# Altium schematic sheet ARM7_Sharp_LH79520_LCD.SchDoc
size B; DocumentNumber: 1; SheetNumber: 1; SheetTotal: 1
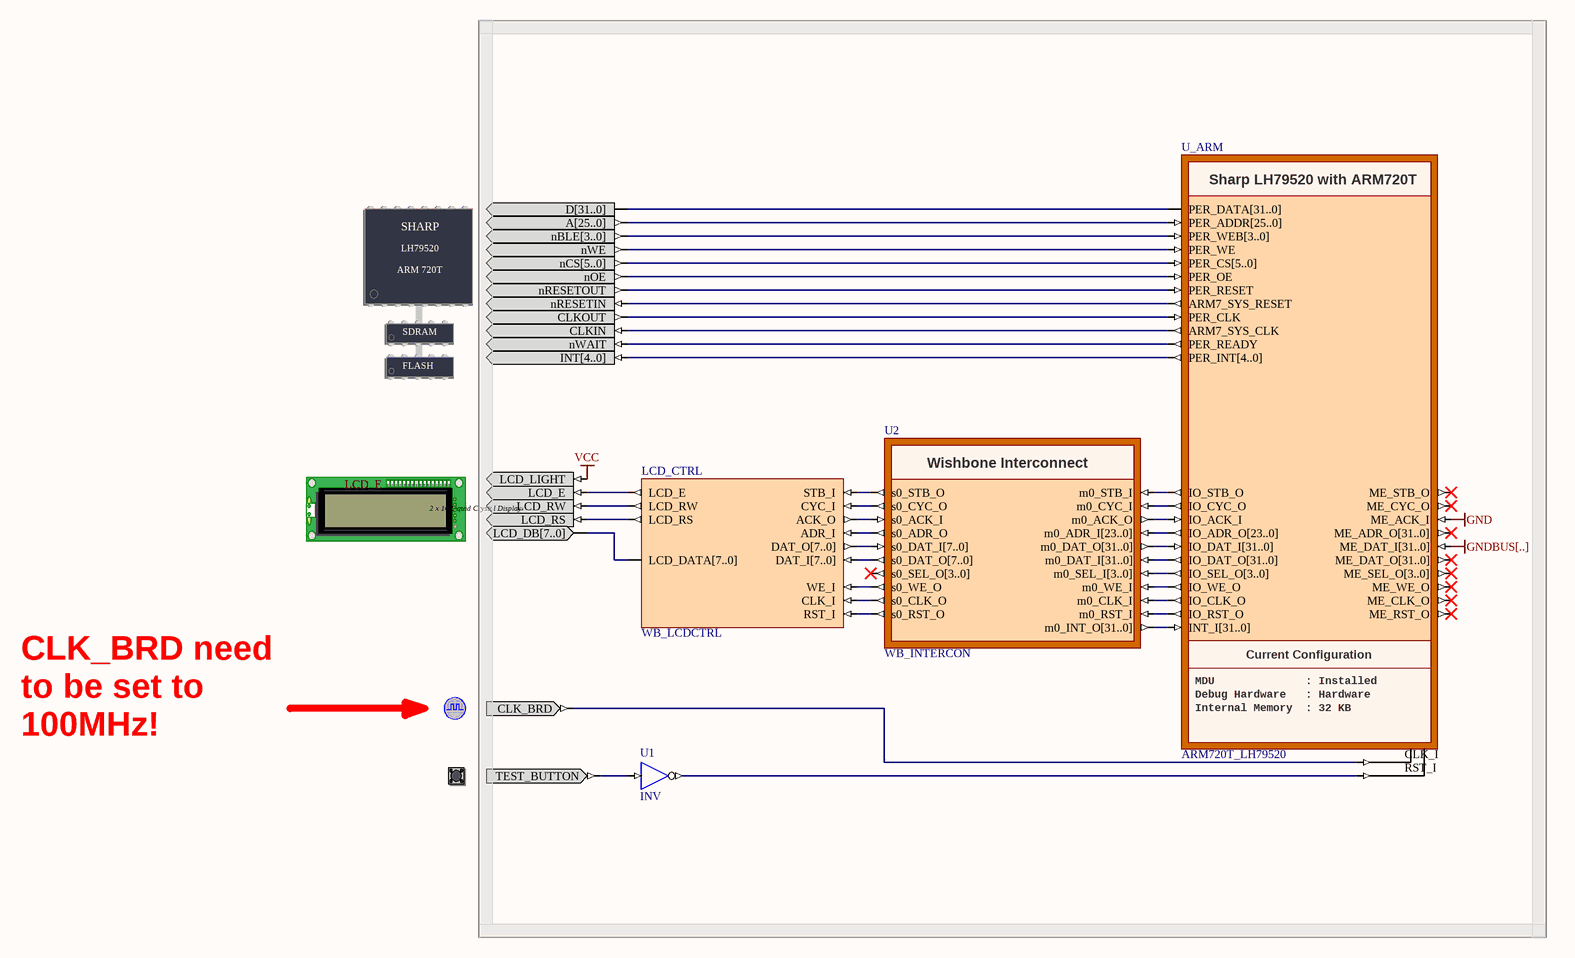
[diagram p0: ARM7_Sharp_LH79520_LCD.SchDoc]

## Parts
(Parts that share a designator on the sheet are numbered #1, #2 ... from top to bottom, then left to right.)
?#1  PROCESSOR_ARM7_LH79520  (value not drawn)
?#2  LCD  (value not drawn)
?#3  CLOCK_BOARD  (value not drawn)
?#4  TEST_BUTTON  (value not drawn)
LCD_CTRL  WB_LCDCTRL
U1  INV
U2  WB_INTERCON
U_ARM  ARM720T_LH79520

## Nets
GND: U_ARM.ME_ACK_I
GNDBUS[..]: U_ARM.ME_DAT_I[31..0]
VCC: ?#2.LCD_LIGHT
Net?#1_A[25..0]: ?#1.A[25..0] U_ARM.PER_ADDR[25..0]
Net?#1_CLKIN: ?#1.CLKIN U_ARM.ARM7_SYS_CLK
Net?#1_CLKOUT: ?#1.CLKOUT U_ARM.PER_CLK
Net?#1_D[31..0]: ?#1.D[31..0] U_ARM.PER_DATA[31..0]
Net?#1_INT[4..0]: ?#1.INT[4..0] U_ARM.PER_INT[4..0]
Net?#1_nBLE[3..0]: ?#1.nBLE[3..0] U_ARM.PER_WEB[3..0]
Net?#1_nCS[5..0]: ?#1.nCS[5..0] U_ARM.PER_CS[5..0]
Net?#1_nOE: ?#1.nOE U_ARM.PER_OE
Net?#1_nRESETIN: ?#1.nRESETIN U_ARM.ARM7_SYS_RESET
Net?#1_nRESETOUT: ?#1.nRESETOUT U_ARM.PER_RESET
Net?#1_nWAIT: ?#1.nWAIT U_ARM.PER_READY
Net?#1_nWE: ?#1.nWE U_ARM.PER_WE
Net?#2_LCD_DB[7..0]: ?#2.LCD_DB[7..0] LCD_CTRL.LCD_DATA[7..0]
Net?#2_LCD_E: ?#2.LCD_E LCD_CTRL.LCD_E
Net?#2_LCD_RS: ?#2.LCD_RS LCD_CTRL.LCD_RS
Net?#2_LCD_RW: ?#2.LCD_RW LCD_CTRL.LCD_RW
Net?#3_CLK_BRD: ?#3.CLK_BRD U_ARM.CLK_I
Net?#4_TEST_BUTTON: ?#4.TEST_BUTTON U1.I
NetLCD_CTRL_ACK_O: LCD_CTRL.ACK_O U2.s0_ACK_I
NetLCD_CTRL_ADR_I: LCD_CTRL.ADR_I U2.s0_ADR_O
NetLCD_CTRL_CLK_I: LCD_CTRL.CLK_I U2.s0_CLK_O
NetLCD_CTRL_CYC_I: LCD_CTRL.CYC_I U2.s0_CYC_O
NetLCD_CTRL_DAT_I[7..0]: LCD_CTRL.DAT_I[7..0] U2.s0_DAT_O[7..0]
NetLCD_CTRL_DAT_O[7..0]: LCD_CTRL.DAT_O[7..0] U2.s0_DAT_I[7..0]
NetLCD_CTRL_RST_I: LCD_CTRL.RST_I U2.s0_RST_O
NetLCD_CTRL_STB_I: LCD_CTRL.STB_I U2.s0_STB_O
NetLCD_CTRL_WE_I: LCD_CTRL.WE_I U2.s0_WE_O
NetU1_O: U1.O U_ARM.RST_I
NetU2_m0_ACK_O: U2.m0_ACK_O U_ARM.IO_ACK_I
NetU2_m0_ADR_I[23..0]: U2.m0_ADR_I[23..0] U_ARM.IO_ADR_O[23..0]
NetU2_m0_CLK_I: U2.m0_CLK_I U_ARM.IO_CLK_O
NetU2_m0_CYC_I: U2.m0_CYC_I U_ARM.IO_CYC_O
NetU2_m0_DAT_I[31..0]: U2.m0_DAT_I[31..0] U_ARM.IO_DAT_O[31..0]
NetU2_m0_DAT_O[31..0]: U2.m0_DAT_O[31..0] U_ARM.IO_DAT_I[31..0]
NetU2_m0_INT_O[31..0]: U2.m0_INT_O[31..0] U_ARM.INT_I[31..0]
NetU2_m0_RST_I: U2.m0_RST_I U_ARM.IO_RST_O
NetU2_m0_SEL_I[3..0]: U2.m0_SEL_I[3..0] U_ARM.IO_SEL_O[3..0]
NetU2_m0_STB_I: U2.m0_STB_I U_ARM.IO_STB_O
NetU2_m0_WE_I: U2.m0_WE_I U_ARM.IO_WE_O

Not connected (* = marked no-connect by the designer): U2 s0_SEL_O[3..0]*; U_ARM ME_ADR_O[31..0]* ME_CLK_O* ME_CYC_O* ME_DAT_O[31..0]* ME_RST_O* ME_SEL_O[3..0]* ME_STB_O* ME_WE_O*

## Notes on the sheet
- CLK_BRD need to be set to 100MHz!
- Labels drawn without touching a wire or pin: LCD_E
- Title
- Size:
- Date:
- B
- Number:
- Time:
- Revision:
- Sheet
- of
- File:
- (in symbol ARM720T_LH79520) Sharp LH79520 with ARM720T; Current Configuration; MDU              : Installed; Debug Hardware   : Hardware; Internal Memory  : 32 KB
- (in symbol LCD) 2 x 16 Liquid Crystal Display
- (in symbol PROCESSOR_ARM7_LH79520) SHARP; LH79520; ARM 720T; SDRAM; FLASH
- (in symbol WB_INTERCON) Wishbone Interconnect

## Library data of the parts
?#1 = PROCESSOR_ARM7_LH79520: Sharp LH79520 with ARM 720T; PortComponent: True; Published: 06-Oct-2005; Publisher: Altium Limited; HelpURL: http://document.sharpsma.com/Handler/getfile_handler2.asp?nodeid=Documents&fileid=F91E6650EC6141068DF7F13902FCDBE4
?#2 = LCD: Liquid Crystal Display; PortComponent: True; Published: 19-Nov-2003; Publisher: Altium Limited; HelpURL: TR0102 NanoBoard Technical Reference Manual - NB1.pdf#page=39
?#3 = CLOCK_BOARD: Global System Clock Supply; PortComponent: True; Published: 19-Nov-2003; Publisher: Altium Limited; HelpURL: TR0102 NanoBoard Technical Reference Manual - NB1.pdf#page=29
?#4 = TEST_BUTTON: Test Button; PortComponent: True; Published: 19-Nov-2003; Publisher: Altium Limited; HelpURL: TR0102 NanoBoard Technical Reference Manual - NB1.pdf#page=41
LCD_CTRL = WB_LCDCTRL: LCD Controller Wishbone; ArchiveName: GENERIC; Published: 9-Dec-2004; Publisher: Altium Limited; ComponentLink1Description: Core &Resource Usage; ComponentLink1URL: CR0139 FPGA Peripheral Resource Usage.pdf#page=56; LastRevisionNo: 1.00.00
U1 = INV: Inverter; FunctionalClass: Logic Primitive; ArchiveName: GENERIC; VHDLIB_SIM: GENERIC_LIB; Published: 29-Jan-2004; Publisher: Altium Limited; XilinxEquivalent: INV; LastRevisionNo: 1.00.00; HelpURL: CR0118 FPGA Generic Library Guide.pdf#page=291; ComponentLink1URL: CR0136 FPGA Logic Primitive Resource Usage.pdf#page=61; ComponentLink1Description: Core &Resource Usage; SubClass: INV
U2 = WB_INTERCON: Configurable Wishbone Interconnect; ConfigurationParameters: {}Version[1.0]{}UnusedInterrupts[1]{}MasterAddressBits[1]{}Name0[LCD]{}Kind0[0]{}SpaceAfter0[4]{}Address_Base0[1048576]{}Address_UsedRange0[1]{}Address_Bits0[1]{}Address_Mode0[1]{}Address_DecodeWidth0[4]{}DataWidth0[2]{}UsedInterrupts0[ ]; ComponentLink1Description: Core &Resource Usage; ComponentLink1URL: CR0139 FPGA Peripheral Resource Usage.pdf#page=52; HelpURL: CR0150 WB_INTERCON Configurable Wishbone Interconnect.pdf; LastRevisionNo: 1.00.00; Published: 9-Dec-2004; Publisher: Altium Limited; ConfiguratorName: WB_INTERCON
U_ARM = ARM720T_LH79520: Sharp LH79520 with ARM 720T; Nexus_JTAG_Device: False; Nexus_Core: Processor_Hard; Nexus_JTAG_Order: 0; ConfigurationParameters: {}Version[1.0]{}Option_Processor[4]{}Option_Memory[5]{}Option_MDU[0]{}Option_OCDS[2]{}Option_Shifter[0]{}Option_InterruptCount[32]{}Option_DebugWhenReset[0]{}; ConfiguratorName: FPGA_MCU32; Memory_Configuration: Record[NEXUS_CORE]{}ComponentDesignator[U_ARM]{}Memory_Depth[16k]{}Memory_UsageType[rom]{}ProgramDownloadAddress[0x00000000]{}Memory_BusType[ARM:local_bus]{}Memory_Mau[8]{}Memory_MatchedComponent[]{}Memory_Description[]{}Memory_FillBitPattern[]{}Memory_Interrupts[]{n}Record[NEXUS_CORE]{}ComponentDesignator[Memory]{}Memory_Depth[16k]{}Memory_UsageType[ram]{}ProgramDownloadAddress[0x4000]{}Memory_BusType[ARM:local_bus]{}Memory_Mau[8]{}Memory_MatchedComponent[]{}Memory_Description[]{}Memory_FillBitPattern[]{}Memory_Interrupts[]{n}Record[CODE_EXPORT]{}ExportType[1]{n}Record[PERIPHERAL]{}ComponentDesignator[LCD]{}Memory_Depth[0x0002]{}Memory_UsageType[ram]{}ProgramDownloadAddress[0x54100000]{}Memory_BusType[ARM:local_bus]{}Memory_Mau[8]{}Memory_MatchedComponent[]{}Memory_Description[U2]{}Memory_FillBitPattern[]{}Memory_Interrupts[]{n}; ProgramLogicalTopAddress: 0; ComponentLink1Description: Core &Resource Usage; HelpURL: http://document.sharpsma.com/Handler/getfile_handler2.asp?nodeid=Documents&fileid=F91E6650EC6141068DF7F13902FCDBE4; LastRevisionNo: 1.00.00; Published: 06-Oct-2005; Publisher: Altium Limited; ComponentLink2Description: Embedded &Tools Guide; ComponentLink2URL: GU0116 Using the ARM Embedded Tools.pdf; ComponentLink3Description: Embedded T&echnical References; ComponentLink3URL: TR0131 ARM Embedded Tools Reference.pdf